# EAGLE design GPSPLLOCXO (EAGLE 7.3.0)
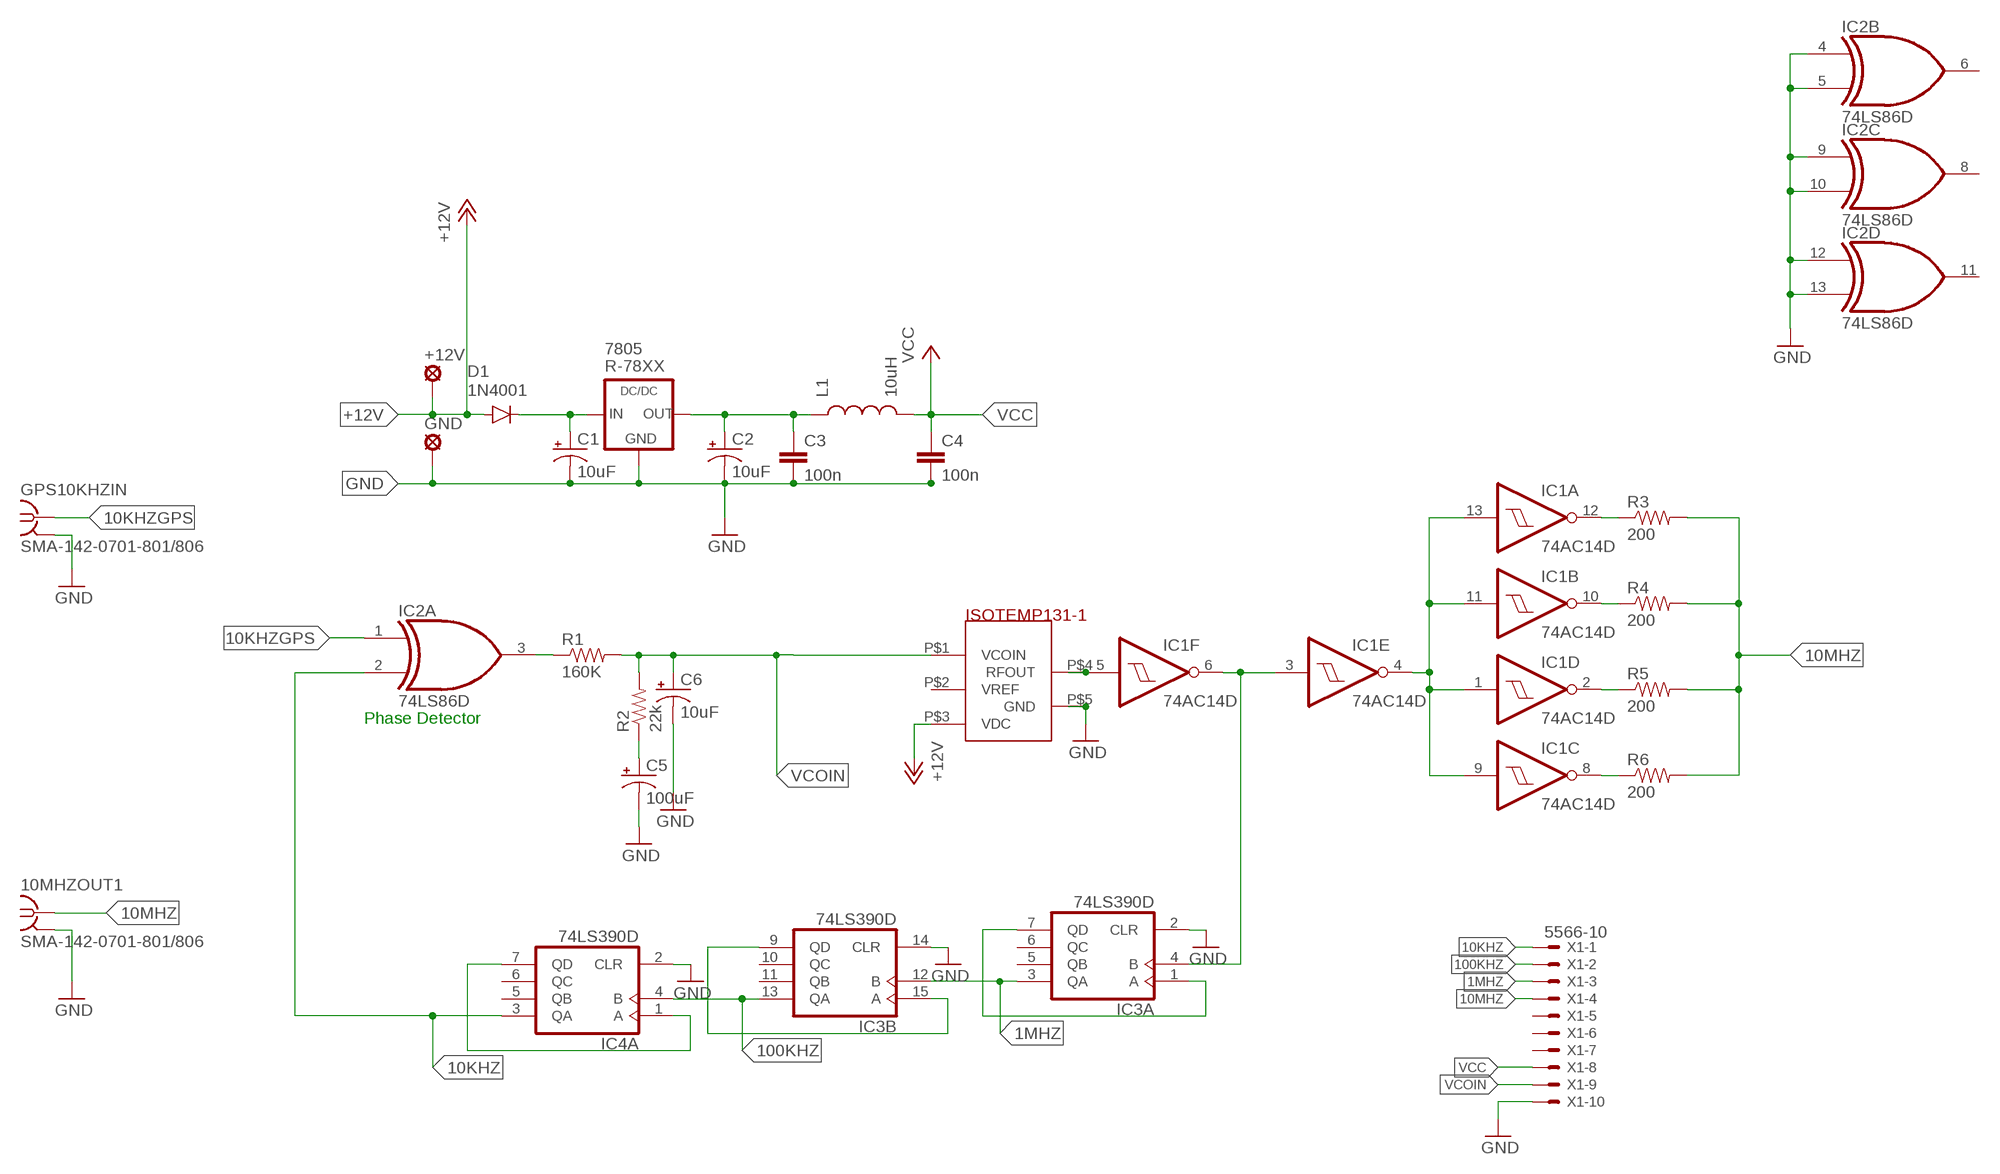
[diagram p0: schematic, sheet 1]

## Parts
10MHZOUT1  SMA-142-0701-801/806  [J502-ND-142-0701-801/806]
7805  R-78XX  [R-78XX]
+12V  LSP13  [LSP13]
C1  10uF  10UF-16V-10%(TANT)  [EIA3216]
C2  10uF  10UF-16V-10%(TANT)  [EIA3216]
C3  100n  1.0UF-25V-+80/-20(0805)  [0805]
C4  100n  1.0UF-25V-+80/-20(0805)  [0805]
C5  100uF  100UF-10V-10%(TANT)  [EIA7343]
C6  10uF  10UF-16V-10%(TANT)  [EIA3216]
D1  1N4001  DIODESMA  [SMA-DIODE]
GND  LSP13  [LSP13]
GPS10KHZIN  SMA-142-0701-801/806  [J502-ND-142-0701-801/806]
IC1  74AC14D  [SO14]
IC2  74LS86D  [SO14]
IC3  74LS390D  [SO16]
IC4  74LS390D  [SO16]
ISOTEMP131-1  ISOTEMP-131-191  [131]
L1  10uH  INDUCTOR1210  [1210]
R1  160K  RESISTOR0805-RES  [0805]
R2  22k  RESISTOR0805-RES  [0805]
R3  200  RESISTOR0805-RES  [0805]
R4  200  RESISTOR0805-RES  [0805]
R5  200  RESISTOR0805-RES  [0805]
R6  200  RESISTOR0805-RES  [0805]
X1  5566-10  [5566-10]

## Nets
1MHZ: IC3.3(A:QA) IC3.12(B:B) X1.3
10KHZ: IC2.2(A:I1) IC4.3(A:QA) X1.1
10KHZGPS: GPS10KHZIN.1 IC2.1(A:I0)
10MHZ: 10MHZOUT1.1 R3.2 R4.2 R5.2 R6.2 X1.4
100KHZ: IC3.13(B:QA) IC4.4(A:B) X1.2
+12V: +12V.MP D1.A ISOTEMP131-1.P$3(VDC)
GND: 10MHZOUT1.G@1 10MHZOUT1.G@2 10MHZOUT1.G@3 10MHZOUT1.G@4 7805.2(GND) C1.C(-) C2.C(-) C3.2 C4.2 C5.C(-) C6.C(-) GND.MP GPS10KHZIN.G@1 GPS10KHZIN.G@2 GPS10KHZIN.G@3 GPS10KHZIN.G@4 IC2.4(B:I0) IC2.5(B:I1) IC2.9(C:I0) IC2.10(C:I1) IC2.12(D:I0) IC2.13(D:I1) IC3.2(A:CLR) IC3.14(B:CLR) IC4.2(A:CLR) ISOTEMP131-1.P$5(GND) X1.10
N$1: 7805.1(IN) C1.A(+) D1.C
N$2: IC2.3(A:O) R1.1
N$4: C5.A(+) R2.1
N$6: IC1.5(F:I) ISOTEMP131-1.P$4(RFOUT)
N$7: IC1.3(E:I) IC1.6(F:O) IC3.4(A:B)
N$8: IC3.1(A:A) IC3.7(A:QD)
N$10: IC3.9(B:QD) IC3.15(B:A)
N$12: IC4.1(A:A) IC4.7(A:QD)
N$14: IC1.1(D:I) IC1.4(E:O) IC1.9(C:I) IC1.11(B:I) IC1.13(A:I)
N$15: IC1.8(C:O) R6.1
N$16: IC1.2(D:O) R5.1
N$17: IC1.10(B:O) R4.1
N$18: IC1.12(A:O) R3.1
VCC: C4.1 L1.2 X1.8
VCC-5V: 7805.3(OUT) C2.A(+) C3.1 L1.1
VCOIN: C6.A(+) ISOTEMP131-1.P$1(VCOIN) R1.2 R2.2 X1.9
Unconnected: IC2.6(B:O) IC2.8(C:O) IC2.11(D:O) IC3.5(A:QB) IC3.6(A:QC) IC3.10(B:QC) IC3.11(B:QB) IC4.5(A:QB) IC4.6(A:QC) IC4.9(B:QD) IC4.10(B:QC) IC4.11(B:QB) IC4.12(B:B) IC4.13(B:QA) IC4.14(B:CLR) IC4.15(B:A) ISOTEMP131-1.P$2(VREF) X1.5 X1.6 X1.7

## Notes on the sheet
- Phase Detector

## Power pins joined to a net without a drawn wire
GND: IC1.7(P:GND) IC2.7(P:GND) IC3.8(P:GND) IC4.8(P:GND)
VCC: IC1.14(P:VCC) IC2.14(P:VCC) IC3.16(P:VCC) IC4.16(P:VCC)

## Library data of the parts
10MHZOUT1 GPS10KHZIN = con-coax:SMA-: SMA 50 Ohm End Launch Jack Receptacle - Round Contact Johnson Components Source: www.johnsoncomponents.com .. J502-ND.pdf; MF: JOHNSON COMPONENTS; MPN: 142-0701-801; OC_FARNELL: 1608592; OC_NEWARK: 90F2624
7805 = recom-intl:R-78XX: DC-DC CONVERTER R-78xx-0.5 Series
+12V GND = solpad:LSP13: SOLDER PAD drill 1.3 mm, distributor Buerklin, 12H562
C1 C2 C6 = SparkFun-Capacitors:10UF-16V-10%(TANT): CAP-00811 1206/EIA-3216 Tantalum capacitor; PROD_ID: CAP-00811
C3 C4 = SparkFun-Capacitors:1.0UF-25V-+80/-20(0805): CAP-11625; PROD_ID: CAP-11625; VALUE: 1.0uF
C5 = SparkFun-Capacitors:100UF-10V-10%(TANT): CAP-07890; PROD_ID: CAP-07890
D1 = SparkFun-DiscreteSemi:DIODE: Diode These are standard reverse protection diodes and small signal diodes. SMA package can handle up to about 1A. SOD-323 can handle about 200mA. What the SOD-323 package when ordering, there are some mfgs out there that are 5-pin packages.
IC1 = 74xx-eu:74*14: Hex schmitt trigger INVERTER
IC2 = 74xx-us:74*86: Quad 2-input EXCLUSIV-OR (XOR) gate
IC3 IC4 = 74xx-us:74*390: Dual 4-bit decade and binary COUNTER
ISOTEMP131-1 = untitled:ISOTEMP-131-191
L1 = SparkFun-Passives:INDUCTOR: Inductors Basic Inductor/Choke - 0603 and 1206. Footprints are not proven and vary greatly between part numbers. SRN6045- 33uH, 20% 1.4A SDR0403-560KL - 56uH, 10%, 500mA RMS/740mA peak
R1-R6 = SparkFun-Passives:RESISTOR: Resistor Basic schematic elements and footprints for 0603, 1206, and PTH resistors.
X1 = con-molex:5566-10: Mini FIT connector 10 pol Source: http://www.molex.com; OC_FARNELL: unknown; OC_NEWARK: unknown

## Board
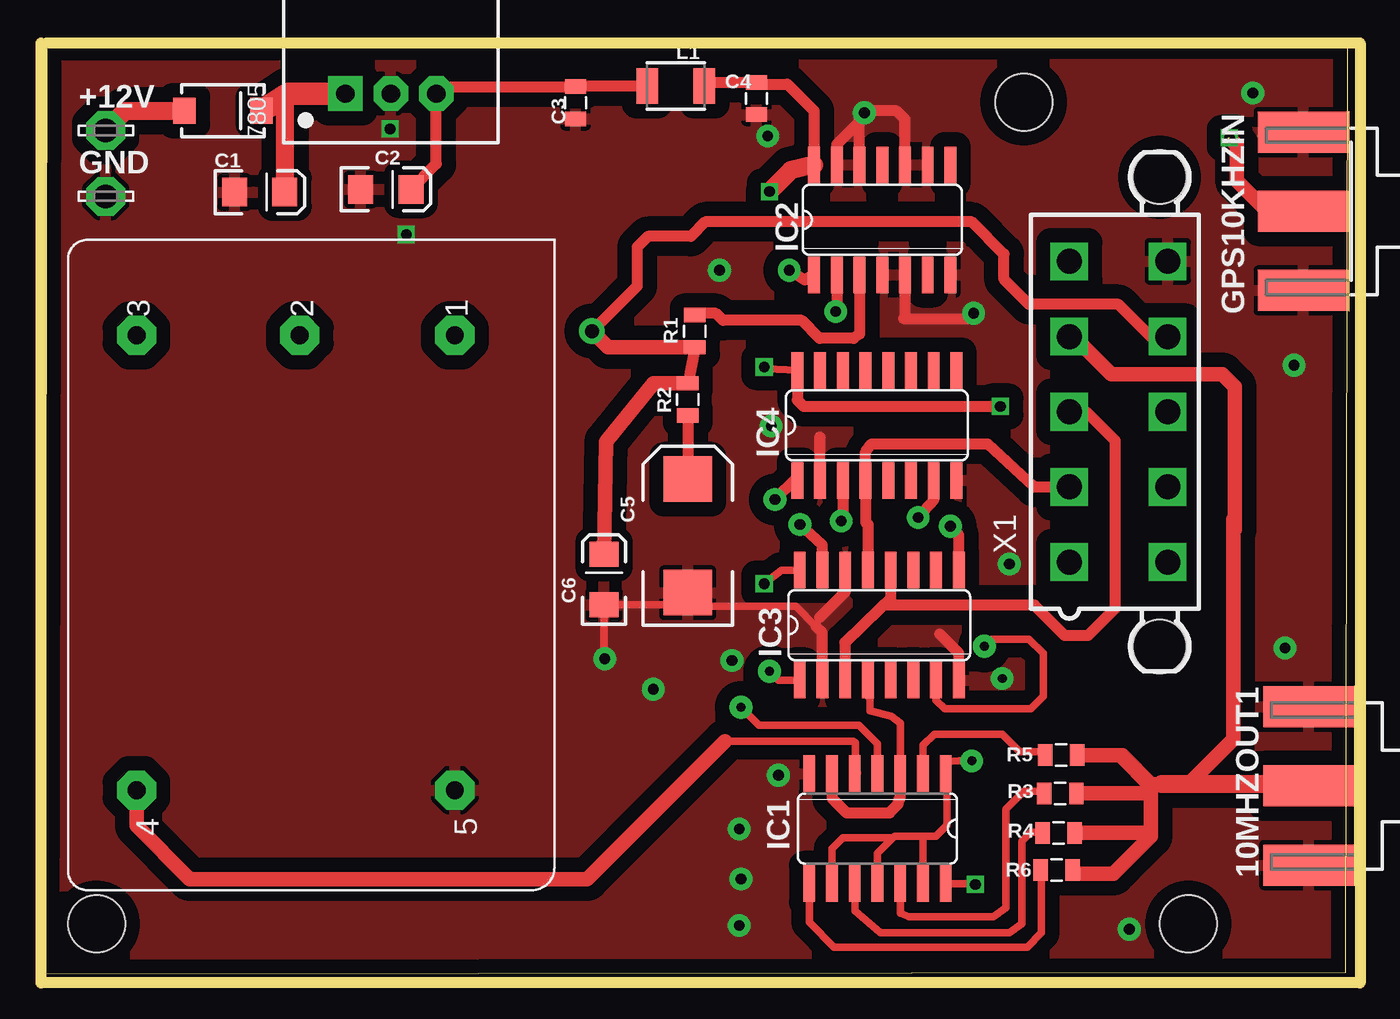
[diagram p1: board, top side]
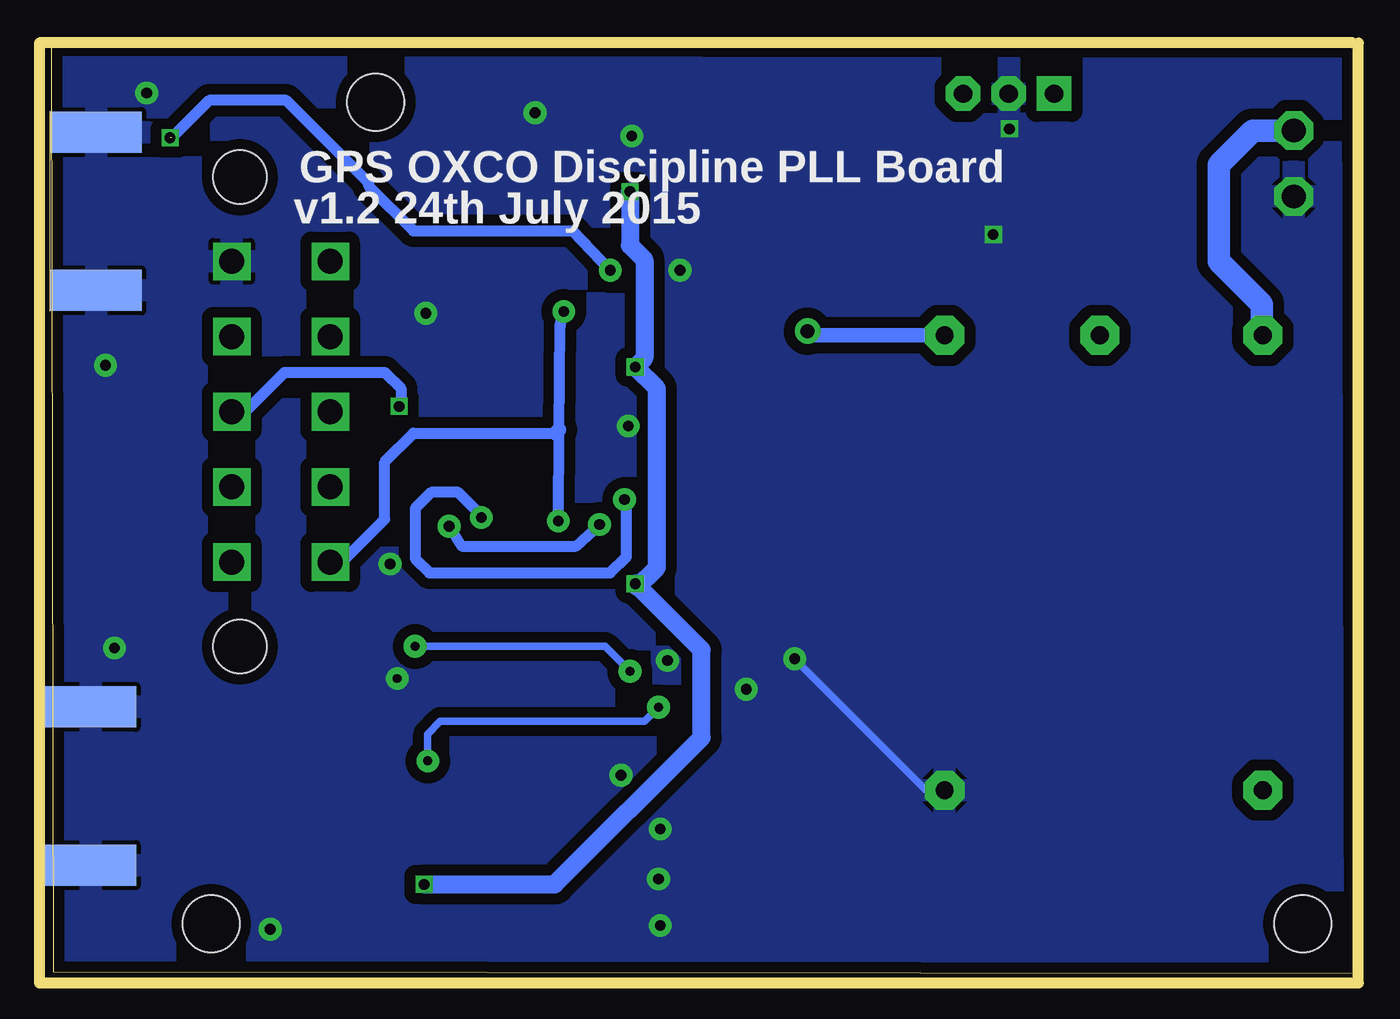
[diagram p2: board, bottom side, seen from below]

Size 72.8 x 51.9 mm. Coordinates in mm from the lower left corner, seen from the top.
Outline: 0,0 72.7,0.1 72.8,51.9 0.1,51.8 0,0
Copper layers (1*16): Top 0.0356mm / dielectric 1.5011mm / Bottom 0.0356mm
Design rules "LaenPCBOrder": minimum track width 6mil, minimum drill 13mil, track to track 6mil, track to pad 6mil, pad to pad 6mil, via to via 6mil, smd to smd 6mil, copper to edge 15mil, drill to drill 6mil, minimum pad ring 7mil, minimum via ring 7mil, stop-mask expansion 3mil, vias tented up to drill 0mil, thermal gap 10mil
Holes 3.2 mm at 2.9,2.8 54.7,48.7 63.9,2.8
Milling: 4 lines

### Footprints (pad centres in the part's own frame; a part is rotated, then mirrored left to right if it is on the bottom)
J502-ND-142-0701-801/806 = smd 5.08 x 2.286: 1 2.565,0; G@1 2.565,4.42; G@2 2.565,-4.42 | smd 5.08 x 2.286 bottom: G@3 2.565,4.42; G@4 2.565,-4.42
R-78XX = drill 1.016 pad 1.93 square: 1 -2.54,0 | drill 1.016 pad 1.93 octagon: 2 0,0; 3 2.54,0
LSP13 = drill 1.321 pad 2.159 octagon: MP 0,0
EIA3216 = smd 1.4 x 1.6: A 1.4,0; C -1.4,0
0805 = smd 0.8 x 1.2: 1 -0.9,0; 2 0.9,0
EIA7343 = smd 2.55 x 2.7: A 3.17,0; C -3.17,0
SMA-DIODE = smd 1.27 x 1.47: A -2.15,0; C 2.15,0
SO14 = smd 0.66 x 2.032: 1 -3.81,-3.073; 2 -2.54,-3.073; 3 -1.27,-3.073; 4 0,-3.073; 5 1.27,-3.073; 6 2.54,-3.073; 7 3.81,-3.073; 8 3.81,3.073; 9 2.54,3.073; 10 1.27,3.073; 11 0,3.073; 12 -1.27,3.073; 13 -2.54,3.073; 14 -3.81,3.073
SO16 = smd 0.66 x 2.032: 1 -4.445,-3.073; 2 -3.175,-3.073; 3 -1.905,-3.073; 4 -0.635,-3.073; 5 0.635,-3.073; 6 1.905,-3.073; 7 3.175,-3.073; 8 4.445,-3.073; 9 4.445,3.073; 10 3.175,3.073; 11 1.905,3.073; 12 0.635,3.073; 13 -0.635,3.073; 14 -1.905,3.073; 15 -3.175,3.073; 16 -4.445,3.073
131 = drill 1 pad 2.184 octagon: P$1 5.334,21.615; P$2 5.334,12.954; P$3 5.334,3.835; P$4 30.734,3.835; P$5 30.734,21.615
1210 = smd 1.2 x 2: 1 -1.6,0; 2 1.6,0
5566-10 = drill 1.4 square: 1 8.4,-2.75; 2 4.2,-2.75; 3 0,-2.75; 4 -4.2,-2.75; 5 -8.4,-2.75; 6 8.4,2.75; 7 4.2,2.75; 8 0,2.75; 9 -4.2,2.75; 10 -8.4,2.75 | hole 3: 13.1,2.29; -13.1,2.29

### Placement (x,y rotation side)
10MHZOUT1  73.2,10.5 180 top
7805  19.34,49.17 0 top
+12V  3.41,47.11 0 top
C1  12.01,43.67 0 top
C2  19.06,43.82 0 top
C3  29.66,48.66 270 top
C4  39.77,48.9 270 top
C5  35.93,24.47 90 top
C6  31.25,22.03 90 top
D1  9.96,48.21 0 top
GND  3.41,43.43 0 top
GPS10KHZIN  72.9,42.6 180 top
IC1  46.53,8.12 180 top
IC2  46.8,42.12 0 top
IC3  46.63,19.48 0 top
IC4  46.5,30.64 0 top
ISOTEMP131-1  1.3,41 270 top
L1  35.26,49.6 0 top
R1  36.33,35.9 270 top
R2  35.93,32.09 90 top
R3  56.74,10.09 0 top
R4  56.65,7.88 0 top
R5  56.79,12.24 0 top
R6  56.54,5.8 0 top
X1  60,31.4 270 top

### Tracks (layer width: path | path; a pad name or v marks a point on that pad's centre or on a via)
1MHZ
  Top 0.61: IC3.12 47.27,20.96 46.69,20.41 | 46.69,20.41 44.7,18.5 44.7,16.43 IC3.3 | X1.3 58.2,31.4 59.8,29.8 59.8,20.4 58.3,18.9 57,18.9 55.3,20.6 46.88,20.6 46.69,20.41
10KHZ  (via drill 0.6 pad 1.27)
  Top 0.61: IC2.2 44.26,37.14 v44.2,37 | IC4.3 44.59,25.11 v44.5,25.3
  Bottom 0.61: v44.5,25.3 44.45,30.4 44.4,36.2 v44.2,37 | X1.1 56.6,23 54.2,25.4 54.2,28.6 52.6,30.2 44.66,30.2
  Bottom 0.813: 44.66,30.2 44.45,30.4
10KHZGPS  (via drill 0.6, 0.6 pad 1.27)  (1 unrouted)
  Top 0.61: IC2.1 42.45,38.75 v41.6,39.3
  Top 0.813: GPS10KHZIN.1 68.3,42.6 66.6,44.3 66.6,46.3 v66.2,46.7
  Bottom 0.61: v41.6,39.3 43.7,41.5 52.6,41.5 55.1,44 55.1,44.2 59.7,48.8 64,48.8 66.1,46.7
10MHZ
  Top 0.813: R6.2 57.44,5.76 57.6,5.6 59.7,5.6 61.8,7.7 61.8,8 | 61.8,8 61.8,10.3 | 61.8,10.3 61.8,10.6 60.2,12.2 | 60.2,12.2 57.73,12.2 R5.2 | R3.2 61.59,10.09 61.8,10.3 | R4.2 61.68,7.88 61.8,8 | 60.2,12.2 60.2,12.1 61.7,10.6 62.4,10.6 63.9,10.6 66.4,13.1 66.4,24.7 | 66.4,24.7 66.4,25.4 | X1.4 57.5,35.6 59.6,33.5 65.8,33.5 66.5,32.8 66.5,24.8 66.4,24.7
  Top 1.016: 10MHZOUT1.1 70.54,10.6 62.4,10.6
100KHZ
  Top 0.61: IC3.13 46,25.1 45.87,25.23 IC4.4 45.87,29.16 46.2,29.6 52.7,29.6 55.3,27.2 X1.2
+12V
  Top 1.016: +12V.MP 4.51,48.21 D1.A
  Bottom 1.27: ISOTEMP131-1.P$3 5.21,35.74 5.21,37.4 7.6,39.8 7.6,45.21 5.7,47.11 +12V.MP
GND  (via drill 0.5 pad 1.27, 0.6, 0.6 pad 1.27)
  Top 0.406: v31.3,17.6 31.25,17.65 C6.C 35.26,20.63 C5.C | 36.16,20.53 41.97,20.53 43.1,19.4
  Top 0.61: 36.16,20.53 C5.C | IC4.2 43.32,29.98 43.3,30 | IC3.14 44.73,21.32 43.3,19.9 | IC3.2 43.45,19.05 43.1,19.4 | IC3.8 51.07,17.93 50,19 | IC2.12 45.53,47.6 | 45.53,47.6 45.53,47.83 v45.8,48.1 45.9,48.2 47.6,48.2 48.07,47.73 IC2.10 | IC2.13 44.26,46.33 45.53,47.6 | 45.83,47.93 46.1,48.2 | 45.53,47.93 45.8,48.2 | IC2.5 48.07,36.67 48,36.6 51.6,36.6 v51.9,36.9
  Bottom 0.406: ISOTEMP131-1.P$5 23.97,10.27 v31.3,17.6
  other vias: 69.3,18.2 69.8,34 53.5,16.5 34,15.9 38.4,17.5 41,11.1 38.8,8.1 40.6,30.6 37.7,39.3 40.4,46.8 38.9,5.3 38.8,2.7 60.6,2.5 67.5,49.2 53.9,22.9 19.3,47.2 20.2,41.3
  pour Bottom (isolate 0.61): -0.2,52.01 74.33,52.51 74.53,-1.13 0,-1.63
  pour Top (isolate 0.813): 0,-0.1 0.1,51.8 73.3,52.1 73.6,-0.4 0.6,0
N$1
  Top 1.016: C1.A 13.44,43.7 13.44,49.06
  Top 1.27: D1.C 13.44,49.06 13.61,49.17 7805.1
N$2
  Top 0.61: IC2.3 45.53,35.73 45.2,35.5 43.3,35.5 42.3,36.5 37.9,36.5 37.5,36.9 36.43,36.9 R1.1
N$4
  Top 0.61: R2.1 C5.A
N$6
  Top 0.406: 38,13 45.2,13 45.3,12.9 45.3,11.23
  Top 0.61: 45.3,11.23 IC1.5
  Top 0.813: ISOTEMP131-1.P$4 5.14,8.27 8.1,5.3 30.3,5.3 38,13
N$7
  Top 0.406: IC1.3 47.8,14 47.3,14.4 46.1,14.7 46.1,15.4 46,15.5 IC3.4
  Top 0.61: IC1.6 43.99,9.81 44.8,9 47.2,9 47.7,9.5 47.7,9.7 47.8,9.8 IC1.3 | IC3.4
N$8  (via drill 0.5 pad 1.27)
  Top 0.406: IC3.1 40.99,16.41 v40.5,16.9 | IC3.7 49.8,15.29 50.3,14.8 55.1,14.8 55.8,15.5 55.8,17.9 55,18.7 52.9,18.7 v52.5,18.3
  Bottom 0.406: v52.5,18.3 41.9,18.3 v40.5,16.9
N$10  (via drill 0.6 pad 1.27)
  Top 0.61: IC3.15 43.45,23.95 v42.2,25.1 | IC3.9 51.07,24.53 v50.6,25
  Bottom 0.61: v50.6,25 49.9,23.9 43.5,23.9 v42.2,25.1
N$12  (via drill 0.6 pad 1.27)
  Top 0.61: IC4.1 41.97,27.67 v40.8,26.5 | IC4.7 49.67,26.48 v48.8,25.5
  Bottom 0.61: v48.8,25.5 48.8,25.6 50.1,26.9 51.6,26.9 52.5,26 52.5,23.2 51.7,22.4 41.6,22.4 40.7,23.3 40.7,26.4 v40.8,26.5
N$14  (via drill 0.5 pad 1.27)
  Top 0.406: IC1.4 46.53,12.87 45.5,13.9 39.9,13.9 v38.9,14.9 | v51.8,11.9 51.1,11.9 50.34,11.84 IC1.1 50.4,11.13 50.4,8.3 49.8,7.7 49.1,7.7 | IC1.11 46.53,6.73 47.4,7.6 | 49.1,7.7 47.5,7.7 47.4,7.6 | IC1.13 49.07,7.67 49.1,7.7 | IC1.9 43.99,6.99 44.6,7.6 47.4,7.6
  Bottom 0.406: v51.8,11.9 51.8,13.4 51.1,14.1 39.7,14.1 v38.9,14.9
N$15
  Top 0.406: IC1.8 42.72,2.88 44.1,1.5 54.9,1.5 55.7,2.3 55.7,5.74 R6.1
N$16
  Top 0.406: IC1.2 49.07,12.77 49.7,13.4 53.5,13.4 54.5,12.4 55.73,12.4 R5.1
N$17
  Top 0.406: IC1.10 45.26,3.54 46.7,2.3 53.9,2.3 54.6,2.8 54.6,7.4 55.1,7.9 55.73,7.9 R4.1
N$18
  Top 0.406: IC1.12 47.8,3.4 48.3,3.2 53,3.2 53.7,3.7 53.7,9.2 54.7,10.2 55.73,10.2 R3.1
VCC  (via drill 0.6)
  Top 0.406: IC4.16 40.29,33.81 v40.2,33.9 | IC3.16 41.15,22.55 v40.2,21.8 | IC1.14 51.95,5.05 v52,5
  Top 0.61: IC4.16 42.05,32.04 42.4,31.7 v53.4,31.7 | L1.2 37.06,49.8 C4.1 39.87,49.7 41.5,49.7 42.99,48.21 IC2.14
  Top 1.016: IC2.14 41.69,44.89 v40.5,43.7
  Bottom 0.406: v40.2,21.8 40.1,21.6
  Bottom 0.61: X1.8 62,31.4 59.8,33.6 54.2,33.6 53.3,32.7 53.3,31.8 v53.4,31.7
  Bottom 1.016: v40.5,43.7 40.5,40.7 39.7,39.9 39.7,34.4 v40.2,33.9 39,32.7 39,22.7 40.1,21.6 | v52,5 44.7,5 36.5,13.2 36.5,18.1 v40.2,21.8
VCC-5V
  Top 0.61: C2.A 21.88,45.24 7805.3 22.27,49.56 C3.1 29.7,49.6 L1.1
VCOIN  (via drill 0.8 pad 1.42)
  Top 0.61: R1.2 R2.2 | X1.9 61.8,35.6 60,37.4 55,37.4 53.6,38.8 53.6,40.2 51.8,42 36.9,42 36.1,41.2 33.7,41.2 33.1,40.6 33.1,38.42 v30.58,35.9
  Top 0.813: R1.2 31.48,35 v30.58,35.9 | R2.2 34.02,32.99 31.35,29.72 C6.A
  Bottom 0.406: 30.58,35.67 v30.58,35.9
  Bottom 0.813: v30.58,35.9 30.58,35.98 | ISOTEMP131-1.P$1 30.58,35.67

### Text on the board
bNames: GPS OXCO Discipline PLL Board | v1.2 24th July 2015